# EAGLE design RedFly-Shield_v14 (EAGLE 6.6.0)
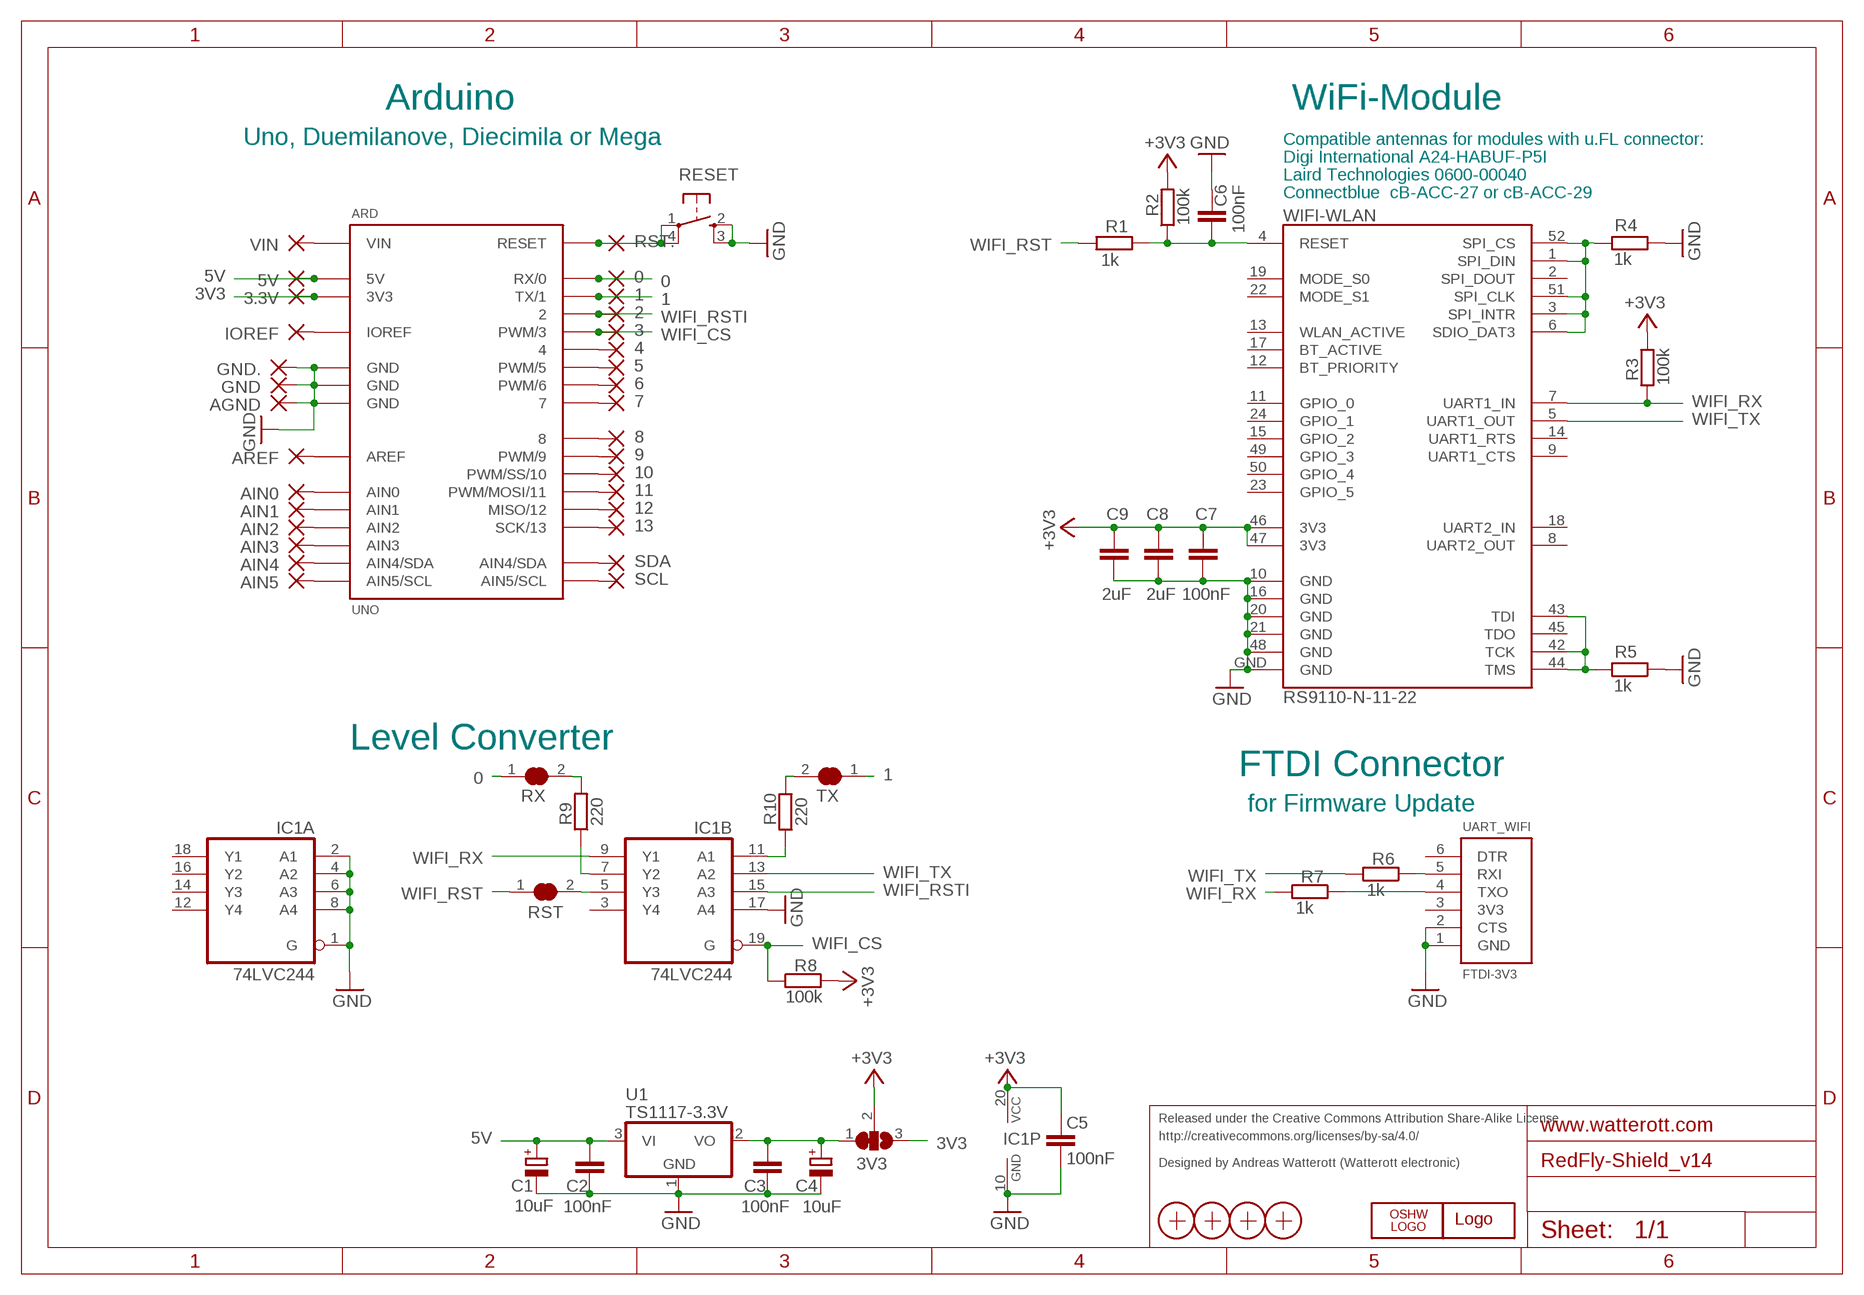
[diagram p0: schematic, sheet 1]

## Parts
0  WIREPAD1,6/0,8  [1,6/0,8]
1  WIREPAD1,6/0,8  [1,6/0,8]
2  WIREPAD1,6/0,8  [1,6/0,8]
3  WIREPAD1,6/0,8  [1,6/0,8]
3.3V  WIREPAD1,6/0,8  [1,6/0,8]
3V3  SJ2W  [SJ_2]
4  WIREPAD1,6/0,8  [1,6/0,8]
5  WIREPAD1,6/0,8  [1,6/0,8]
5V  WIREPAD1,6/0,8  [1,6/0,8]
6  WIREPAD1,6/0,8  [1,6/0,8]
7  WIREPAD1,6/0,8  [1,6/0,8]
8  WIREPAD1,6/0,8  [1,6/0,8]
9  WIREPAD1,6/0,8  [1,6/0,8]
10  WIREPAD1,6/0,8  [1,6/0,8]
11  WIREPAD1,6/0,8  [1,6/0,8]
12  WIREPAD1,6/0,8  [1,6/0,8]
13  WIREPAD1,6/0,8  [1,6/0,8]
AGND  WIREPAD1,6/0,8  [1,6/0,8]
AIN0  WIREPAD1,6/0,8  [1,6/0,8]
AIN1  WIREPAD1,6/0,8  [1,6/0,8]
AIN2  WIREPAD1,6/0,8  [1,6/0,8]
AIN3  WIREPAD1,6/0,8  [1,6/0,8]
AIN4  WIREPAD1,6/0,8  [1,6/0,8]
AIN5  WIREPAD1,6/0,8  [1,6/0,8]
ARD  UNO  [UNO]
AREF  WIREPAD1,6/0,8  [1,6/0,8]
C1  10uF  CPOL-EU153CLV-0505  [153CLV-0505]
C2  100nF  C-EUC0603  [C0603]
C3  100nF  C-EUC0603  [C0603]
C4  10uF  CPOL-EU153CLV-0505  [153CLV-0505]
C5  100nF  C-EUC0603  [C0603]
C6  100nF  C-EUC0603  [C0603]
C7  100nF  C-EUC0603  [C0603]
C8  2uF  C-EUC0603  [C0603]
C9  2uF  C-EUC0603  [C0603]
GND  WIREPAD1,6/0,8  [1,6/0,8]
GND.  WIREPAD1,6/0,8  [1,6/0,8]
IC1  74LVC244  74HC244DW  [SO20W]
IOREF  WIREPAD1,6/0,8  [1,6/0,8]
LOGO1  WE-LOGO  [WE-LOGO]
LOGO2  OSHW_LOGO_6MILX0100-NT  [OSHW_6X100_NOTEXT]
R1  1k  R-EU_R0603  [R0603]
R2  100k  R-EU_R0603  [R0603]
R3  100k  R-EU_R0603  [R0603]
R4  1k  R-EU_R0603  [R0603]
R5  1k  R-EU_R0603  [R0603]
R6  1k  R-EU_R0603  [R0603]
R7  1k  R-EU_R0603  [R0603]
R8  100k  R-EU_R0603  [R0603]
R9  220  R-EU_R0603  [R0603]
R10  220  R-EU_R0603  [R0603]
RESET  SW_SMDS  [SW_SMD4@1]
RST  SJ  [SJ]
RST.  WIREPAD1,6/0,8  [1,6/0,8]
RX  SJ  [SJ]
SCL  WIREPAD1,6/0,8  [1,6/0,8]
SDA  WIREPAD1,6/0,8  [1,6/0,8]
TX  SJ  [SJ]
U1  TS1117-3.3V  TS1117  [SOT223]
UART_WIFI  FTDI-3V3  FTDI  [FTDI]
VIN  WIREPAD1,6/0,8  [1,6/0,8]
WIFI-WLAN  RS9110-N-11-22  RS9110-N-11-21  [RS9110-N-11-21]
X1  PASSER  [PASSER]
X2  PASSER  [PASSER]
X3  PASSER  [PASSER]
X4  PASSER  [PASSER]

## Nets
0: 0.1(P) ARD.0(RX/0) RX.1
1: 1.1(P) ARD.1(TX/1) TX.1
3V3: 3.3V.1(P) 3V3.3 ARD.3V3
3V_OUT: 3V3.1 C3.1 C4.+ U1.2(VO)
5V: 5V.1(P) ARD.5V C1.+ C2.1 U1.3(VI)
+3V3: 3V3.2 C5.1 C7.1 C8.1 C9.1 IC1.20(P:VCC) R2.2 R3.1 R8.2 WIFI-WLAN.46(3V3) WIFI-WLAN.47(3V3)
A0: AIN0.1(P) ARD.AIN0
A1: AIN1.1(P) ARD.AIN1
AREF: ARD.AREF AREF.1(P)
GND: AGND.1(P) ARD.GND@1(GND) ARD.GND@2(GND) ARD.GND@3(GND) C1.- C2.2 C3.2 C4.- C5.2 C6.1 C7.2 C8.2 C9.2 GND.1(P) GND..1(P) IC1.1(A:G) IC1.2(A:A1) IC1.4(A:A2) IC1.6(A:A3) IC1.8(A:A4) IC1.10(P:GND) IC1.17(B:A4) R4.1 R5.1 RESET.2(S) RESET.3(S1) U1.1(GND) UART_WIFI.1(GND) UART_WIFI.2(CTS) WIFI-WLAN.10(GND) WIFI-WLAN.16(GND) WIFI-WLAN.20(GND) WIFI-WLAN.21(GND) WIFI-WLAN.48(GND) WIFI-WLAN.GND
IOREF: ARD.IOREF IOREF.1(P)
N$1: ARD.SCL(AIN5/SCL) SCL.1(P)
N$5: R5.2 WIFI-WLAN.42(TCK) WIFI-WLAN.43(TDI) WIFI-WLAN.44(TMS)
N$6: ARD.SDA(AIN4/SDA) SDA.1(P)
N$7: R4.2 WIFI-WLAN.1(SPI_DIN) WIFI-WLAN.3(SPI_INTR) WIFI-WLAN.6(SDIO_DAT3) WIFI-WLAN.51(SPI_CLK) WIFI-WLAN.52(SPI_CS)
N$8: 4.1(P) ARD.4
N$9: 5.1(P) ARD.5(PWM/5)
N$10: 6.1(P) ARD.6(PWM/6)
N$11: 7.1(P) ARD.7
N$12: 8.1(P) ARD.8
N$13: 9.1(P) ARD.9(PWM/9)
N$14: 10.1(P) ARD.10(PWM/SS/10)
N$15: 11.1(P) ARD.11(PWM/MOSI/11)
N$16: 12.1(P) ARD.12(MISO/12)
N$17: 13.1(P) ARD.13(SCK/13)
N$20: AIN2.1(P) ARD.AIN2
N$21: AIN3.1(P) ARD.AIN3
N$22: AIN4.1(P) ARD.AIN4(AIN4/SDA)
N$23: AIN5.1(P) ARD.AIN5(AIN5/SCL)
N$103: R6.1 UART_WIFI.5(RXI)
N$104: R7.1 UART_WIFI.4(TXO)
RST: ARD.RST(RESET) RESET.1(P) RESET.4(P1) RST..1(P)
VIN: ARD.VIN VIN.1(P)
WIFI_CS: 3.1(P) ARD.3(PWM/3) IC1.19(B:G) R8.1
WIFI_RST: R1.2 RST.1
WIFI_RST2: C6.2 R1.1 R2.1 WIFI-WLAN.4(RESET)
WIFI_RSTI: 2.1(P) ARD.2 IC1.15(B:A3)
WIFI_RSTO: IC1.5(B:Y3) RST.2
WIFI_RX: IC1.9(B:Y1) R3.2 R7.2 WIFI-WLAN.7(UART1_IN)
WIFI_RX2: R10.1 TX.2
WIFI_RXI: IC1.11(B:A1) R10.2
WIFI_TX: IC1.13(B:A2) R6.2 WIFI-WLAN.5(UART1_OUT)
WIFI_TX2: R9.2 RX.2
WIFI_TXO: IC1.7(B:Y2) R9.1
Unconnected: IC1.3(B:Y4) IC1.12(A:Y4) IC1.14(A:Y3) IC1.16(A:Y2) IC1.18(A:Y1) UART_WIFI.3(3V3) UART_WIFI.6(DTR) WIFI-WLAN.2(SPI_DOUT) WIFI-WLAN.8(UART2_OUT) WIFI-WLAN.9(UART1_CTS) WIFI-WLAN.11(GPIO_0) WIFI-WLAN.12(BT_PRIORITY) WIFI-WLAN.13(WLAN_ACTIVE) WIFI-WLAN.14(UART1_RTS) WIFI-WLAN.15(GPIO_2) WIFI-WLAN.17(BT_ACTIVE) WIFI-WLAN.18(UART2_IN) WIFI-WLAN.19(MODE_S0) WIFI-WLAN.22(MODE_S1) WIFI-WLAN.23(GPIO_5) WIFI-WLAN.24(GPIO_1) WIFI-WLAN.45(TDO) WIFI-WLAN.49(GPIO_3) WIFI-WLAN.50(GPIO_4)

## Notes on the sheet
- Arduino | WiFi-Module
- Uno, Duemilanove, Diecimila or Mega | Compatible antennas for modules with u.FL connector:
- Digi International A24-HABUF-P5I
- Laird Technologies 0600-00040
- Connectblue  cB-ACC-27 or cB-ACC-29
- Level Converter
- FTDI Connector
- for Firmware Update
- Released under the Creative Commons Attribution Share-Alike License
- http://creativecommons.org/licenses/by-sa/4.0/
- Designed by Andreas Watterott (Watterott electronic)

## Library data of the parts
0 1-3 3.3V 4 5 5V 6-13 AGND AIN0 AIN1-AIN5 AREF GND GND. IOREF RST. SCL SDA VIN = wirepad:WIREPAD: Wire PAD connect wire on PCB
3V3 = jumper:SJ2W: SMD solder JUMPER
ARD = Arduino:UNO
C1 C4 = rcl:CPOL-EU: POLARIZED CAPACITOR, European symbol
C2 C3 C5-C9 = rcl:C-EU: CAPACITOR, European symbol
IC1 = 74xx-eu:74*244: Octal BUFFER and LINE DRIVER, 3-state
LOGO1 = welectronic:WE-LOGO
LOGO2 = OSHW:OSHW_LOGO_6MIL
R1-R10 = rcl:R-EU_: RESISTOR, European symbol
RESET = Switch-SMD:SW_SMD
RST RX TX = jumper:SJ: SMD solder JUMPER
U1 = Voltage-Reg:TS1117
UART_WIFI = Arduino:FTDI: 6pol FTDI Connector
WIFI-WLAN = RedpineSignals:RS9110-N-11-21: Redpine Signals Connect-io-n RS9110-N-11-21 / -22
X1-X4 = SMD:PASSER

## Board
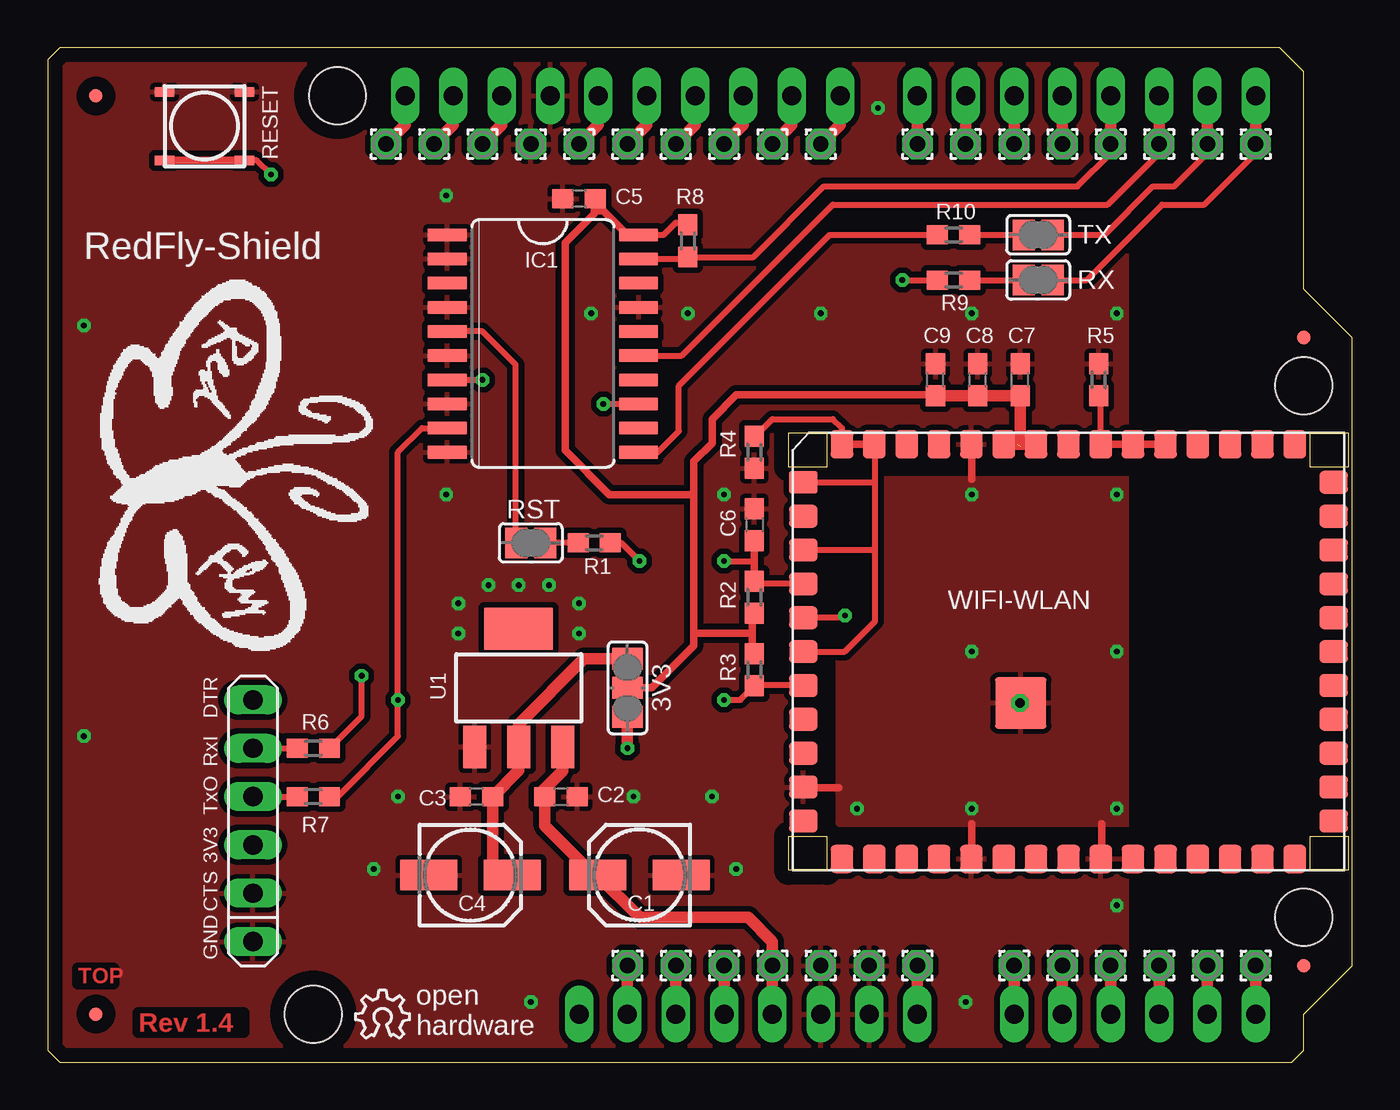
[diagram p1: board, top side]
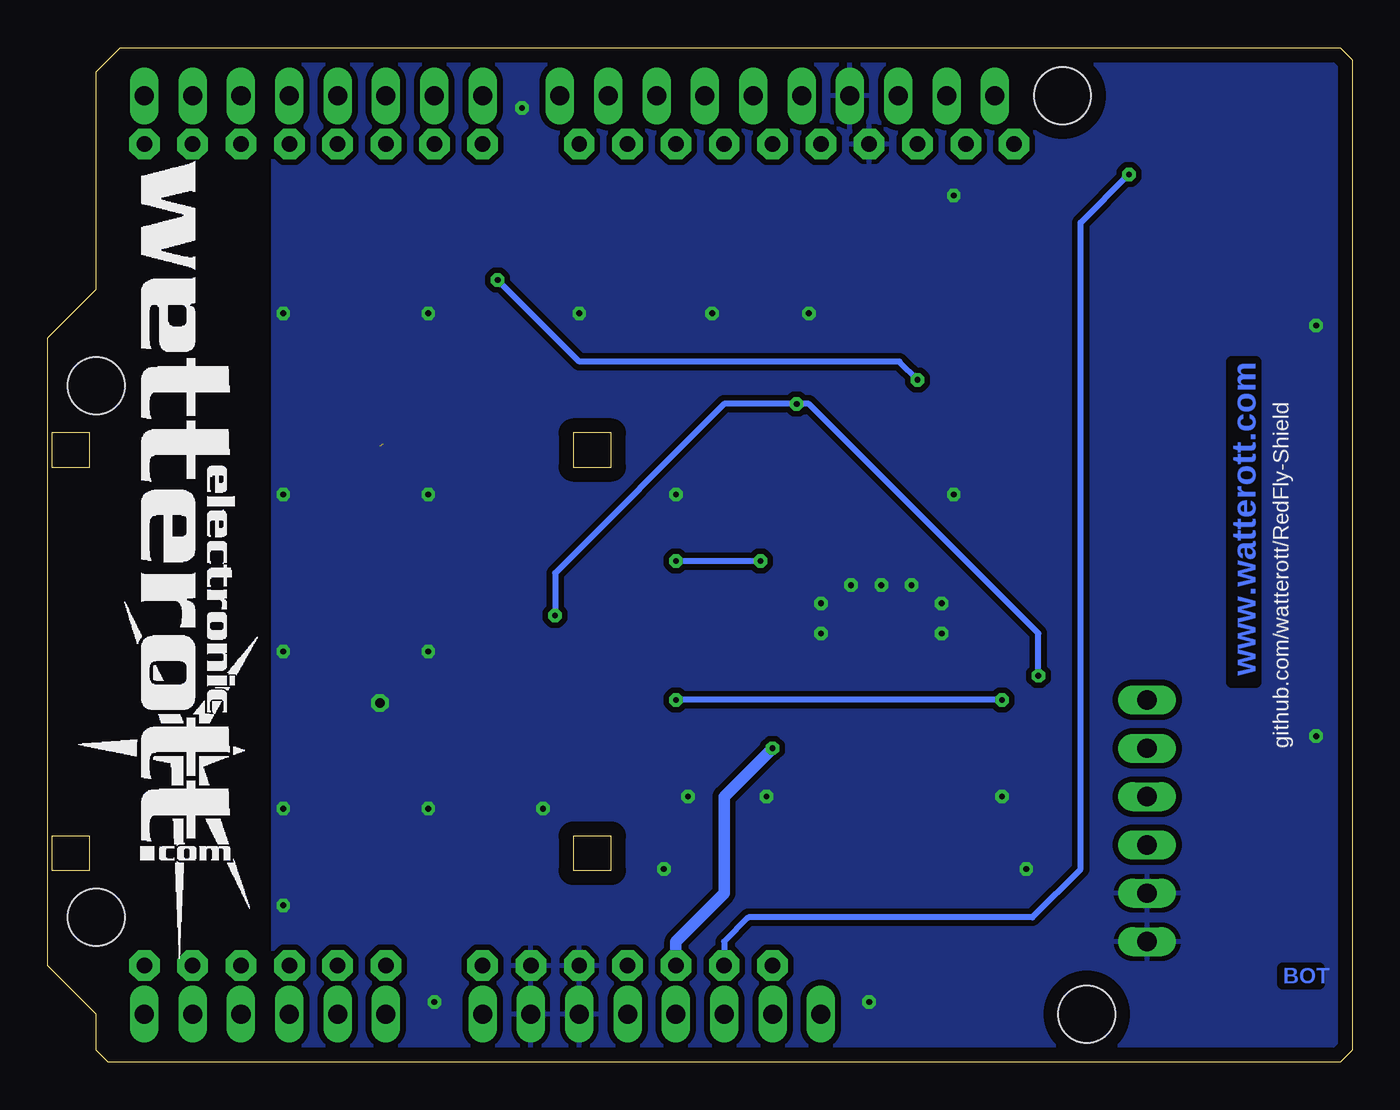
[diagram p2: board, bottom side, seen from below]

Size 68.58 x 53.34 mm. Coordinates in mm from the lower left corner, seen from the top.
Copper layers (1*16): Top 0.035mm / dielectric 1.5mm / Bottom 0.035mm
Design rules "default *": minimum track width 8mil, minimum drill 0.3mm, track to track 8mil, track to pad 8mil, pad to pad 8mil, via to via 8mil, smd to smd 8mil, copper to edge 30mil, drill to drill 8mil, minimum pad ring 10mil, minimum via ring 8mil, stop-mask expansion 4mil, vias tented up to drill 0.5mm, thermal gap 10mil
tRestrict: area 57.1,0 to 68.6,53.3
bRestrict: area 57.1,0 to 68.6,53.3

### Footprints (pad centres in the part's own frame; a part is rotated, then mirrored left to right if it is on the bottom)
1,6/0,8 = drill 0.813 pad 1.6 octagon: 1 0,0
SJ_2 = smd 1.168 x 1.6: 1 -1.524,0; 2 0,0; 3 1.524,0
UNO = drill 1 long: 0 63.5,50.8; 1 60.96,50.8; 2 58.42,50.8; 3 55.88,50.8; 3V3 35.56,2.54; 4 53.34,50.8; 5 50.8,50.8; 5V 38.1,2.54; 6 48.26,50.8; 7 45.72,50.8; 8 41.656,50.8; 9 39.116,50.8; 10 36.576,50.8; 11 34.036,50.8; 12 31.496,50.8; 13 28.956,50.8; AIN0 50.8,2.54; AIN1 53.34,2.54; AIN2 55.88,2.54; AIN3 58.42,2.54; AIN4 60.96,2.54; AIN5 63.5,2.54; AREF 23.876,50.8; GND@1 40.64,2.54; GND@2 43.18,2.54; GND@3 26.416,50.8; IOREF 30.48,2.54; NC 27.94,2.54; RST 33.02,2.54; SCL 18.796,50.8; SDA 21.336,50.8; VIN 45.72,2.54 | hole 3: 66.04,35.56; 66.04,7.62; 15.24,50.8; 13.97,2.54
153CLV-0505 = smd 3 x 1.6: + 2.2,0; - -2.2,0
C0603 = smd 1.1 x 1: 1 -0.85,0; 2 0.85,0
SO20W = smd 0.66 x 2.032: 1 -5.715,-5.029; 2 -4.445,-5.029; 3 -3.175,-5.029; 4 -1.905,-5.029; 5 -0.635,-5.029; 6 0.635,-5.029; 7 1.905,-5.029; 8 3.175,-5.029; 9 4.445,-5.029; 10 5.715,-5.029; 11 5.715,5.029; 12 4.445,5.029; 13 3.175,5.029; 14 1.905,5.029; 15 0.635,5.029; 16 -0.635,5.029; 17 -1.905,5.029; 18 -3.175,5.029; 19 -4.445,5.029; 20 -5.715,5.029
R0603 = smd 1.1 x 1: 1 -0.85,0; 2 0.85,0
SW_SMD4@1 = smd 0.508 x 1.016: 1 -1.8,-2.1; 2 1.8,-2.1; 3 1.8,2.1; 4 -1.8,2.1
SJ = smd 1.168 x 1.6: 1 -0.762,0; 2 0.762,0
SOT223 = smd 1.219 x 2.235: 1 -2.311,-3.099; 2 0,-3.099; 3 2.311,-3.099 | smd 3.6 x 2.2: 4 0,3.099
FTDI = drill 1.016 long: 1 -6.35,0; 2 -3.81,0; 3 -1.27,0; 4 1.27,0; 5 3.81,0; 6 6.35,0
RS9110-N-11-21 = smd 1.2 x 1.5: 1 -8.9,-13.932; 2 -7.12,-13.932; 3 -5.34,-13.932; 4 -3.56,-13.932; 5 -1.78,-13.932; 6 0,-13.932; 7 1.78,-13.932; 8 3.56,-13.932; 9 5.34,-13.932; 10 7.12,-13.932; 11 8.9,-13.932; 27 8.9,13.94; 28 7.12,13.94; 29 5.34,13.94; 30 3.56,13.94; 31 1.78,13.94; 32 0,13.94; 33 -1.78,13.94; 34 -3.56,13.94; 35 -5.34,13.94; 36 -7.12,13.94; 37 -8.9,13.94 | smd 1.5 x 1.2: 12 10.9,-11.9; 13 10.9,-10.2; 14 10.9,-8.5; 15 10.9,-6.8; 16 10.9,-5.1; 17 10.9,-3.4; 18 10.9,-1.7; 19 10.9,0; 20 10.9,1.7; 21 10.9,3.4; 22 10.9,5.1; 23 10.9,6.8; 24 10.9,8.5; 25 10.9,10.2; 26 10.9,11.9; 38 -10.9,11.9; 39 -10.9,10.2; 40 -10.9,8.5; 41 -10.9,6.8; 42 -10.9,5.1; 43 -10.9,3.4; 44 -10.9,1.7; 45 -10.9,0; 46 -10.9,-1.7; 47 -10.9,-3.4; 48 -10.9,-5.1; 49 -10.9,-6.8; 50 -10.9,-8.5; 51 -10.9,-10.2; 52 -10.9,-11.9 | smd 2.7 x 2.7: GND 2.7,-2.5
PASSER = smd 0.7 x 0.7: X 0,0

### Placement (x,y rotation side)
0  63.5,48.26 0 top
1  60.96,48.26 0 top
2  58.42,48.26 0 top
3  55.88,48.26 0 top
3.3V  35.56,5.08 0 top
3V3  30.48,19.68 270 top
4  53.34,48.26 0 top
5  50.8,48.26 0 top
5V  38.1,5.08 0 top
6  48.26,48.26 0 top
7  45.72,48.26 0 top
8  40.64,48.26 0 top
9  38.1,48.26 0 top
10  35.56,48.26 0 top
11  33.02,48.26 0 top
12  30.48,48.26 0 top
13  27.94,48.26 0 top
AGND  25.4,48.26 180 top
AIN0  50.8,5.08 0 top
AIN1  53.34,5.08 0 top
AIN2  55.88,5.08 0 top
AIN3  58.42,5.08 0 top
AIN4  60.96,5.08 0 top
AIN5  63.5,5.08 0 top
ARD  0,0 0 top
AREF  22.86,48.26 0 top
C1  31.11,9.84 180 top
C2  26.99,13.97 0 top
C3  22.54,13.97 180 top
C4  22.23,9.84 0 top
C5  27.94,45.4 180 top
C6  37.15,28.26 270 top
C7  51.12,35.88 90 top
C8  48.9,35.88 90 top
C9  46.67,35.88 90 top
GND  43.18,5.08 0 top
GND.  40.64,5.08 0 top
IC1  26.04,37.78 270 top
IOREF  30.48,5.08 0 top
LOGO1  67.31,47.62 270 bottom
LOGO2  16.19,1.27 0 top
R1  28.73,27.3 180 top
R2  37.15,24.45 270 top
R3  37.15,20.64 270 top
R4  37.15,32.07 90 top
R5  55.24,35.88 270 top
R6  13.97,16.51 0 top
R7  13.97,13.97 0 top
R8  33.66,43.18 90 top
R9  47.62,41.12 0 top
R10  47.62,43.5 180 top
RESET  8.26,49.21 90 top
RST  25.4,27.3 180 top
RST.  33.02,5.08 0 top
RX  52.07,41.12 180 top
SCL  17.78,48.26 0 top
SDA  20.32,48.26 0 top
TX  52.07,43.5 180 top
U1  24.77,19.68 0 top
UART_WIFI  10.79,12.7 90 top
VIN  45.72,5.08 0 top
WIFI-WLAN  53.66,21.59 270 top
X1  2.54,2.54 0 top
X2  2.54,50.8 0 top
X3  66.04,38.1 0 top
X4  66.04,5.08 0 top

### Tracks (layer width: path | path; a pad name or v marks a point on that pad's centre or on a via)
0
  Top 0.305: RX.1 54.61,41.12 58.58,45.09 60.8,45.09 63.5,47.78 0.1
  Top 0.61: 0.1 ARD.0
1
  Top 0.305: TX.1 55.56,43.5 58.1,46.04 59.21,46.04 60.96,47.78 1.1
  Top 0.61: 1.1 ARD.1
3V3  (via drill 0.3)
  Top 0.61: v30.48,16.51 3V3.3 | ARD.3V3 3.3V.1
  Bottom 0.61: v30.48,16.51 33.02,13.97 33.02,8.89 35.56,6.35 3.3V.1
3V_OUT
  Top 0.61: 3V3.1 28.19,21.21 24.77,17.78 U1.2 24.77,15.34 C3.1 23.39,10.42 23.97,9.84 C4.+
5V
  Top 0.305: 26.04,14.07 26.04,14.29
  Top 0.61: U1.3 27.08,15.33 26.04,14.29 | 26.04,14.07 C2.1 26.14,12.44 28.57,10 28.76,10 C1.+ | C1.+ 28.89,9.84 31.11,7.62 36.83,7.62 38.1,6.35 5V.1 ARD.5V | C1.+
+3V3  (1 unrouted)
  Top 0.305: 51.12,32.38 51.12,32.39 | IC1.20 32.38,43.5 33.02,44.13 33.55,44.13 R8.2 | 37.05,23.5 R2.2 | 37.05,21.59 R3.1
  Top 0.406: 3V3.2 31.75,19.68 33.97,21.91 33.97,22.54 | 33.97,29.84 33.97,31.59 34.92,32.54 34.92,33.81 36.2,35.08 46.62,35.08 C9.1 | 33.97,22.54 33.97,29.84 | 37.05,22.54 37.05,21.59 | 37.05,22.54 37.05,23.5 | 33.97,22.54 37.05,22.54 | 33.97,29.84 29.53,29.84 27.2,32.17 27.2,43.08 28.73,44.61 28.73,44.77 | 28.73,44.77 28.73,45.35 C5.1 | IC1.20 30.48,43.5 29.21,44.77 28.73,44.77
  Top 0.61: WIFI-WLAN.46 50.96,32.49 | 50.96,32.49 WIFI-WLAN.47 | C9.1 C8.1 C7.1 51.12,32.65 50.96,32.49
A0
  Top 0.61: ARD.AIN0 AIN0.1
A1
  Top 0.61: ARD.AIN1 AIN1.1
AREF
  Top 0.61: ARD.AREF 23.88,49.28 AREF.1
GND  (via drill 0.3, 0.5)
  Top 0.406: 39.85,14.45 41.59,14.45 | 48.58,10.79 48.58,12.54 | 55.4,12.54 55.4,10.79 | 48.58,32.38 48.58,30.64
  other vias: 48.26,3.17 48.58,29.84 42.55,13.34 48.58,13.34 56.2,13.34 48.58,39.37 18.41,13.97 30.8,13.97 35.56,29.84 21.59,22.54 27.94,22.54 23.18,25.08 26.35,25.08 24.77,25.08 21.59,24.13 27.94,24.13 17.14,10.16 36.2,10.16 20.95,29.84 33.66,39.37 56.2,29.84 56.2,39.37 48.58,21.59 56.2,21.59 40.64,39.37 34.92,13.97 43.66,50.16 56.2,8.26 1.91,38.73 1.91,17.14 51.12,18.89 25.4,3.17 28.57,39.37 20.95,45.56
  pour Bottom (isolate 0.305): 0,53.34 68.58,53.34 68.58,0 0,0
  pour Top (isolate 0.305): 0,0 0,53.34 68.58,53.34 68.58,0
IOREF
  Top 0.61: ARD.IOREF IOREF.1
N$1
  Top 0.61: ARD.SCL 18.8,49.28 SCL.1
N$2
  Top 0.406: 24.77,27.3 26.04,27.3
N$4
  Top 0.254: 51.12,43.5 53.02,43.5
N$5
  Top 0.305: WIFI-WLAN.44 55.36,34.91 R5.2
  Top 0.406: WIFI-WLAN.42 WIFI-WLAN.43 WIFI-WLAN.44
N$6
  Top 0.61: ARD.SDA 21.34,49.28 SDA.1
N$7
  Top 0.305: 43.5,26.99 43.5,23.18 41.91,21.59 WIFI-WLAN.6 | 43.5,26.99 43.5,30.48 | 43.5,30.48 43.5,32.07 43.5,32.35 | WIFI-WLAN.3 43.44,26.93 43.5,26.99 | R4.2 37.2,32.92 38.1,33.81 41.27,33.81 41.76,33.33 WIFI-WLAN.52 | WIFI-WLAN.1 43.49,30.49 43.5,30.48
  Top 0.406: WIFI-WLAN.52 WIFI-WLAN.51 43.46,32.11 43.5,32.07
N$8
  Top 0.61: 4.1 ARD.4
N$9
  Top 0.61: 5.1 ARD.5
N$10
  Top 0.61: 6.1 ARD.6
N$11
  Top 0.61: 7.1 ARD.7
N$12
  Top 0.61: ARD.8 41.66,49.28 8.1
N$13
  Top 0.61: ARD.9 39.12,49.28 9.1
N$14
  Top 0.61: ARD.10 36.58,49.28 10.1
N$15
  Top 0.61: ARD.11 34.04,49.28 11.1
N$16
  Top 0.61: ARD.12 31.5,49.28 12.1
N$17
  Top 0.61: ARD.13 28.96,49.28 13.1
N$20
  Top 0.61: ARD.AIN2 AIN2.1
N$21
  Top 0.61: ARD.AIN3 AIN3.1
N$22
  Top 0.61: ARD.AIN4 AIN4.1
N$23
  Top 0.61: ARD.AIN5 AIN5.1
N$24
  Top 0.254: 51.12,41.12 53.02,41.12
N$31
  Top 0.406: 30.48,19.68 30.48,21.27
N$103
  Top 0.305: UART_WIFI.5 R6.1
N$104
  Top 0.305: UART_WIFI.4 R7.1
RST  (via drill 0.3)
  Top 0.305: RESET.1 11.01,47.41 v11.75,46.67
  Top 0.406: RESET.1 RESET.4
  Top 0.61: RST..1 ARD.RST
  Bottom 0.305: v11.75,46.67 14.29,44.13 14.29,10.16 16.83,7.62 31.75,7.62 33.02,6.35 RST..1
VIN
  Top 0.61: ARD.VIN VIN.1
WIFI_CS
  Top 0.305: IC1.19 33.66,42.23 R8.1 37.09,42.33 40.8,46.04 54.13,46.04 55.88,47.78 3.1
  Top 0.61: 3.1 ARD.3
WIFI_RST
  Top 0.305: R1.2 RST.1
WIFI_RST2  (via drill 0.3)
  Top 0.305: R1.1 30.16,27.3 v31.11,26.35 | v35.56,26.35 37.15,26.35 | WIFI-WLAN.4 37.15,25.15 R2.1
  Top 0.406: R2.1 37.15,26.35 C6.2
  Bottom 0.305: v31.11,26.35 v35.56,26.35
WIFI_RSTI
  Top 0.305: IC1.15 33.34,37.15 41.27,45.09 55.72,45.09 58.42,47.78 2.1
  Top 0.61: 2.1 ARD.2
WIFI_RSTO
  Top 0.305: IC1.5 22.86,38.42 24.61,36.67 24.61,27.34 RST.2
WIFI_RX  (via drill 0.3)
  Top 0.305: R7.2 15.24,13.97 18.41,17.14 v18.41,19.05 18.41,32.07 19.68,33.34 IC1.9 | v35.56,19.05 36.41,19.05 R3.2 37.15,19.81 WIFI-WLAN.7
  Bottom 0.305: v18.41,19.05 v35.56,19.05
WIFI_RX2
  Top 0.305: R10.1 TX.2 | TX.2
WIFI_RXI
  Top 0.305: IC1.11 32.07,32.07 33.18,33.18 33.18,35.56 | 33.18,35.56 | 33.18,35.56 41.12,43.5 R10.2
WIFI_TX  (via drill 0.3)
  Top 0.305: v29.21,34.61 IC1.13 | 14.92,16.61 R6.2 16.51,18.2 v16.51,20.32 | WIFI-WLAN.5 41.78,23.37 v41.91,23.5
  Bottom 0.305: v29.21,34.61 28.89,34.61 | v41.91,23.5 41.91,25.72 33.02,34.61 v29.21,34.61 | v16.51,20.32 16.51,22.54 28.57,34.61 v29.21,34.61
WIFI_TX2
  Top 0.305: R9.2 RX.2 | RX.2
WIFI_TXO  (via drill 0.3)
  Top 0.305: IC1.7 v22.86,35.88 | v44.93,41.12 R9.1 | R9.1
  Bottom 0.305: v22.86,35.88 23.81,36.83 40.64,36.83 v44.93,41.12

### Text on the board
Top: TOP | Rev 1.4
Bottom: www.watterott.com | BOT
tPlace: RedFly-Shield | open | hardware
bPlace: github.com/watterott/RedFly-Shield
Reference: Silkscreen: 21 tPlace + 25 tNames + 22 bPlace